# Altium schematic sheet other.SchDoc
size A4
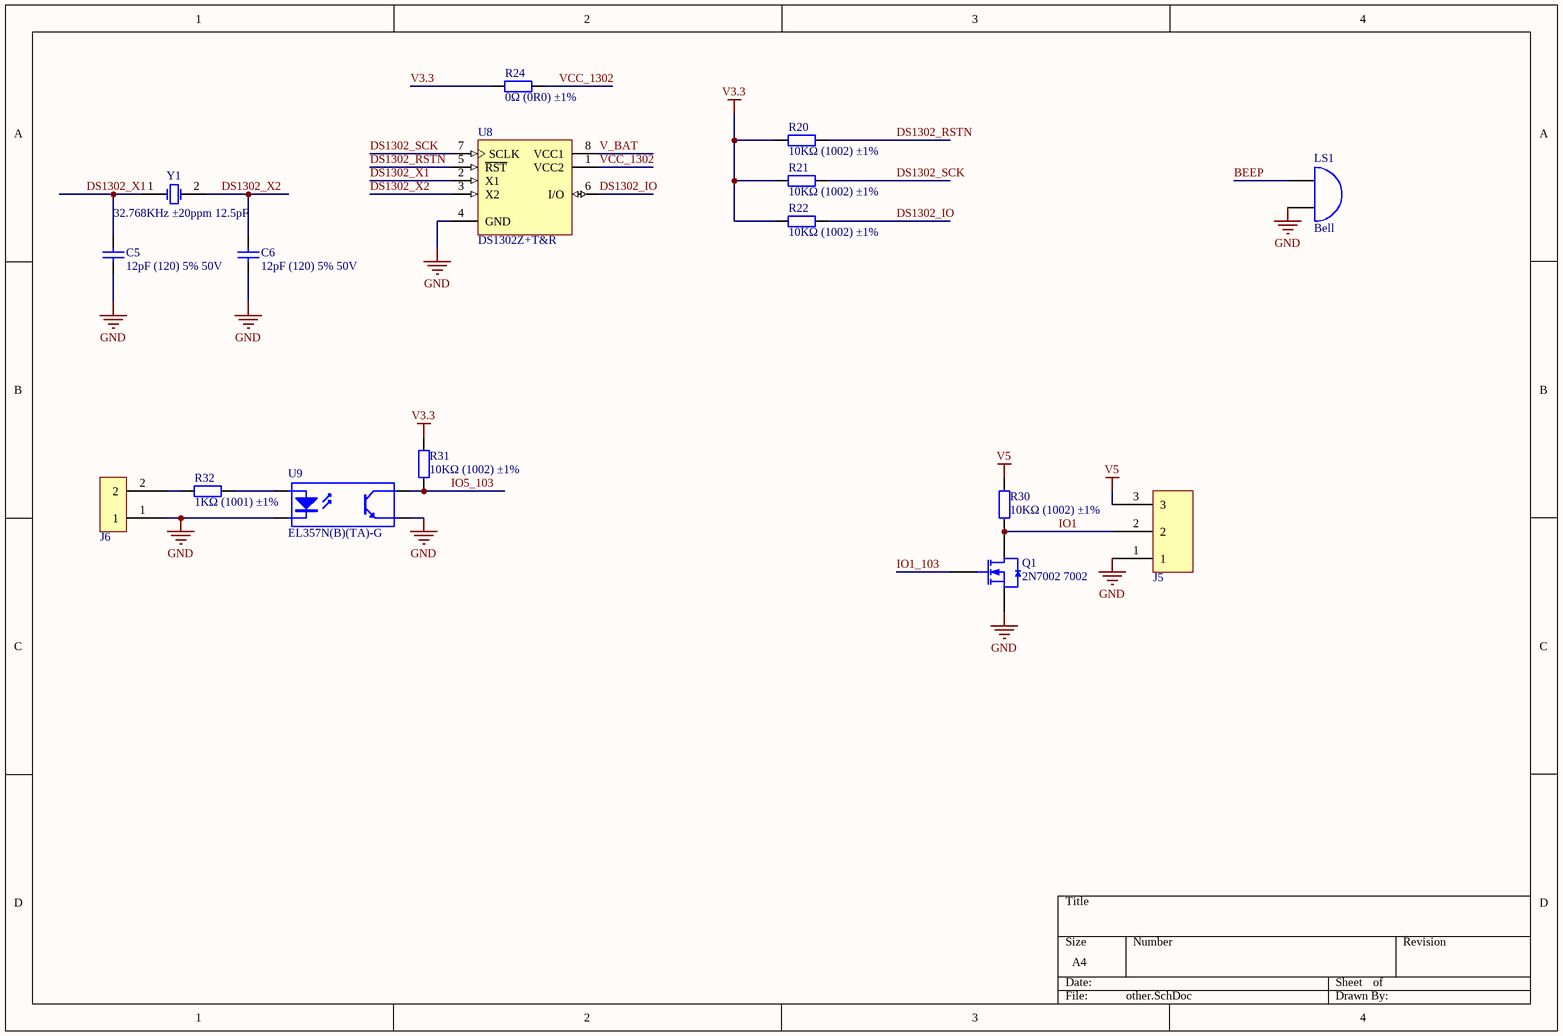
[diagram p0: other.SchDoc]

## Parts
C5  12pF (120) 5% 50V  [0402_C]
C6  12pF (120) 5% 50V  [0402_C]
J5  KF301-3P  [KF301-3P]  (value not drawn)
J6  KF301-2P  [KF301-2P]  (value not drawn)
LS1  Bell  [PIN2]
Q1  2N7002 7002  [SOT-23(SOT-23-3)]
R20  10KΩ (1002) ±1%  [0402_R]
R21  10KΩ (1002) ±1%  [0402_R]
R22  10KΩ (1002) ±1%  [0402_R]
R24  0Ω (0R0) ±1%  [1206_R]
R30  10KΩ (1002) ±1%  [1206_R]
R31  10KΩ (1002) ±1%  [1206_R]
R32  1KΩ (1001) ±1%  [1206_R]
U8  DS1302Z+T&R  [SOIC-8_150mil]
U9  EL357N(B)(TA)-G  [SOP-4_P2.54]
Y1  32.768KHz ±20ppm 12.5pF  [SMD-3215_2P FC - 135]

## Nets
GND: C5.1 C6.1 J5.1 J6.1 LS1.2(B) Q1.2(S) U8.4(GND) U9.2(K) U9.3(E)
V3.3: R20.1 R21.1 R22.1 R24.1 R31.2
V5: J5.3 R30.2
BEEP: LS1.1(A)
DS1302_IO: R22.2 U8.6(I/O)
DS1302_RSTN: R20.2 U8.5(~{RST})
DS1302_SCK: R21.2 U8.7(SCLK)
DS1302_X1: C5.2 U8.2(X1) Y1.1(OSC1)
DS1302_X2: C6.2 U8.3(X2) Y1.2(OSC2)
IO1: J5.2 Q1.3(D) R30.1
IO1_103: Q1.1(G)
IO5_103: R31.1 U9.4(C)
V_BAT: U8.8(VCC1)
VCC_1302: R24.2 U8.1(VCC2)
NetJ6_2: J6.2 R32.1
NetR32_2: R32.2 U9.1(A)

## Library data of the parts
C5 C6 = 0402 12pF (120) 5% 50V: 贴片电容; ComponentLink1Description: 供应商链接; ComponentLink1URL: http://www.szlcsc.com/product/details_1899.html; Package: 0402; Supplier: LC; SuppliersPartNumber: C1547
LS1 = Bell: Electrical Bell; Published: 24-Mar-1999; LatestRevisionDate: 17-Jul-2002; LatestRevisionNote: Re-released for DXP Platform.; PackageReference: PIN2; Publisher: Altium Limited
Q1 = 2N7002 7002: MOS(场效应管); ComponentLink1Description: 供应商链接; ComponentLink1URL: http://www.szlcsc.com/product/details_9040.html; Package: SOT-23(SOT-23-3); Supplier: LC; SuppliersPartNumber: C8545
R20-R22 = 0402 10KΩ (1002) 1%: 贴片电阻; ComponentLink1Description: 供应商链接; ComponentLink1URL: http://www.szlcsc.com/product/details_26487.html; Package: 0402; Supplier: LC; SuppliersPartNumber: C25744
R24 = 1206 0Ω (0R0) 1%: 贴片电阻; ComponentLink1Description: 供应商链接; ComponentLink1URL: http://www.szlcsc.com/product/details_18576.html; Package: 1206; Supplier: LC; SuppliersPartNumber: C17888
R30 R31 = 1206 10KΩ (1002) 1%: 贴片电阻; ComponentLink1Description: 供应商链接; ComponentLink1URL: http://www.szlcsc.com/product/details_18590.html; Package: 1206; Supplier: LC; SuppliersPartNumber: C17902
R32 = 1206 1KΩ (1001) 1%: 贴片电阻; ComponentLink1Description: 供应商链接; ComponentLink1URL: http://www.szlcsc.com/product/details_4817.html; Package: 1206; Supplier: LC; SuppliersPartNumber: C4410
U8 = DS1302Z+T&R_[C8959]: 实时时钟; ComponentLink1Description: 供应商链接; ComponentLink1URL: http://www.szlcsc.com/product/details_9478.html; Package: SOIC-8_150mil; Supplier: LC; SuppliersPartNumber: C8959
U9 = EL357N(B)(TA)-G_[C6649]: 贴片光耦; ComponentLink1Description: 供应商链接; ComponentLink1URL: http://www.szlcsc.com/product/details_7114.html; Package: SOP-4_P2.54; Supplier: LC; SuppliersPartNumber: C6649
Y1 = SMD-3215_2P 32.768KHz 20ppm 12.5pF: 贴片晶振; ComponentLink1Description: 供应商链接; ComponentLink1URL: http://www.szlcsc.com/product/details_33310.html; Package: SMD-3215_2P; Supplier: LC; SuppliersPartNumber: C32346